# EAGLE schematic Eagle_LEDCUBE2 (EAGLE 6.5.0)

## Sheet 1 of 6: First Controller bank
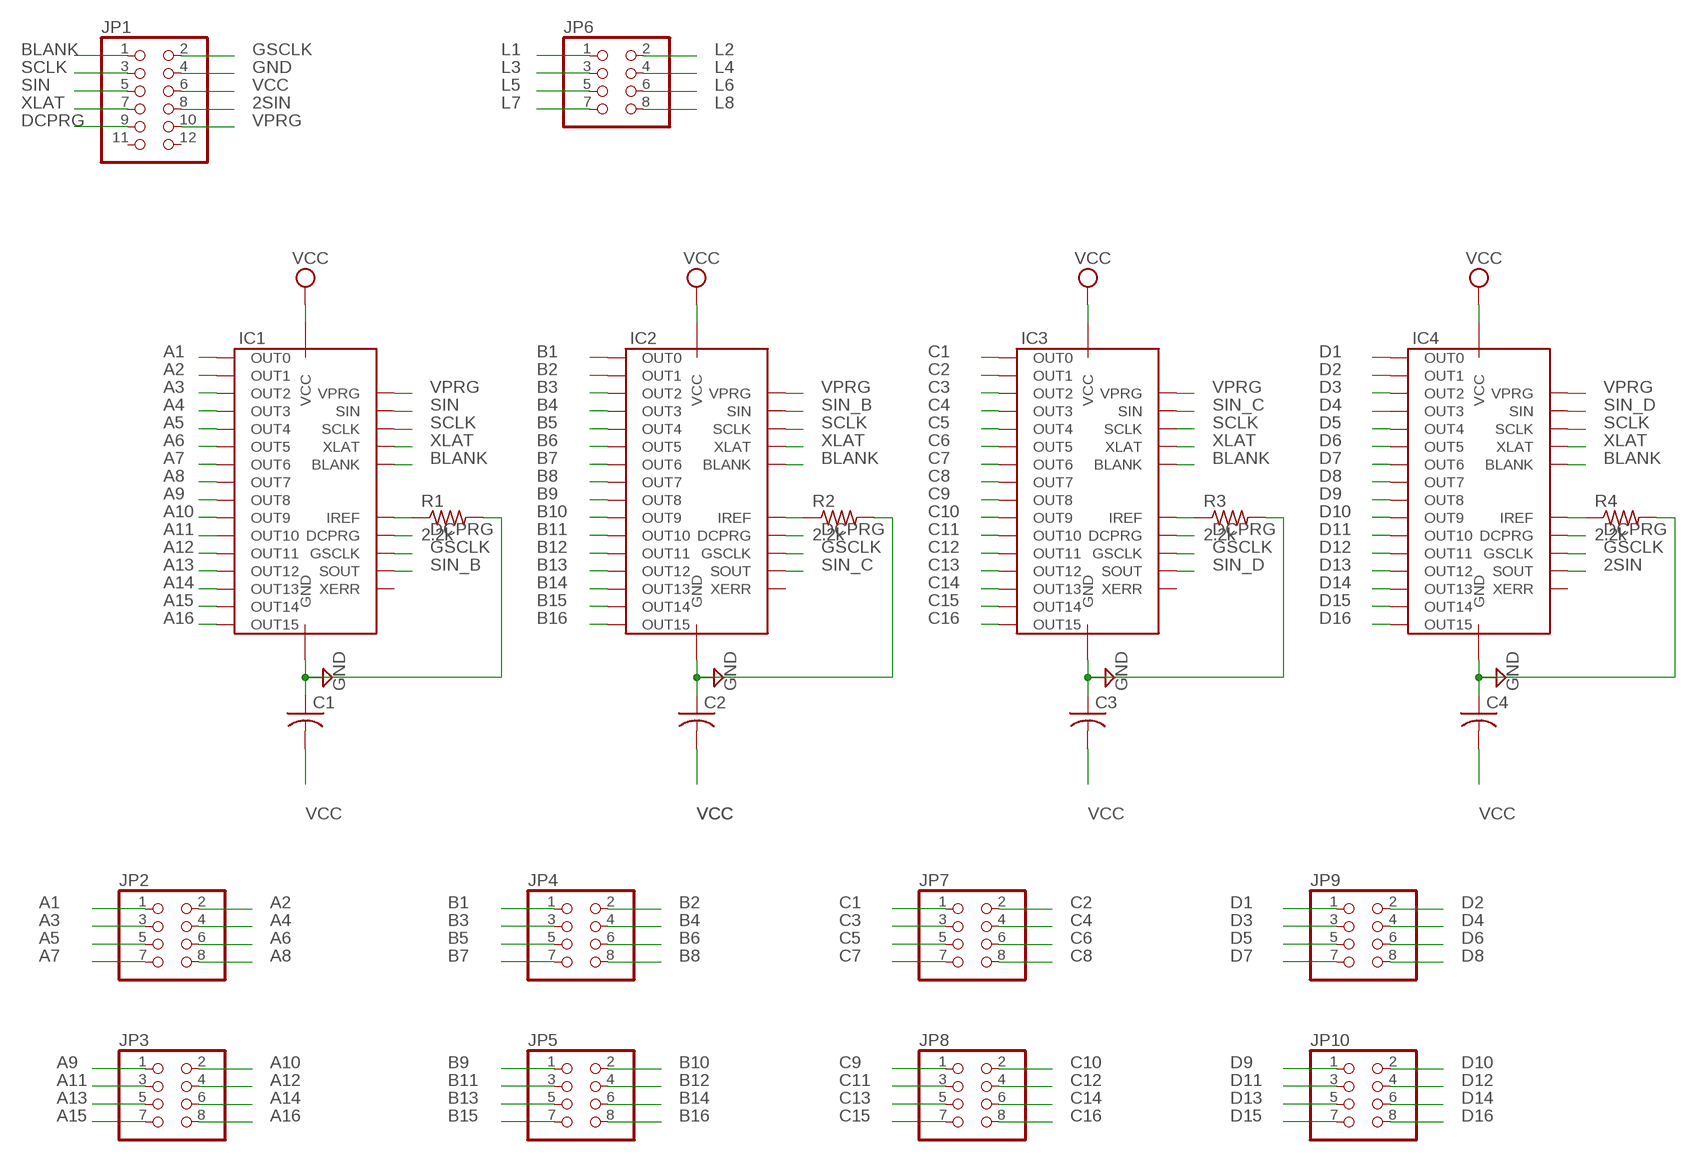
[diagram p0: schematic, sheet 1]

### Parts
C1  C-USC0805K  [C0805K]
C2  C-USC0805K  [C0805K]
C3  C-USC0805K  [C0805K]
C4  C-USC0805K  [C0805K]
IC1  IC-PACKAGE_DIL28-1  [IC-SSOP28]
IC2  IC-PACKAGE_DIL28-1  [IC-SSOP28]
IC3  IC-PACKAGE_DIL28-1  [IC-SSOP28]
IC4  IC-PACKAGE_DIL28-1  [IC-SSOP28]
JP1  PINHD-2X6  [2X06]
JP2  PINHD-2X4  [2X04]
JP3  PINHD-2X4  [2X04]
JP4  PINHD-2X4  [2X04]
JP5  PINHD-2X4  [2X04]
JP6  PINHD-2X4  [2X04]
JP7  PINHD-2X4  [2X04]
JP8  PINHD-2X4  [2X04]
JP9  PINHD-2X4  [2X04]
JP10  PINHD-2X4  [2X04]
R1  2.2k  R-US_R0805  [R0805]
R2  2.2k  R-US_R0805  [R0805]
R3  2.2k  R-US_R0805  [R0805]
R4  2.2k  R-US_R0805  [R0805]

### Nets
2SIN: IC4.24(SOUT) JP1.8 ; also sheet 2
A1: IC1.7(OUT0) JP2.1
A2: IC1.8(OUT1) JP2.2
A3: IC1.9(OUT2) JP2.3
A4: IC1.10(OUT3) JP2.4
A5: IC1.11(OUT4) JP2.5
A6: IC1.12(OUT5) JP2.6
A7: IC1.13(OUT6) JP2.7
A8: IC1.14(OUT7) JP2.8
A9: IC1.15(OUT8) JP3.1
A10: IC1.16(OUT9) JP3.2
A11: IC1.17(OUT10) JP3.3
A12: IC1.18(OUT11) JP3.4
A13: IC1.19(OUT12) JP3.5
A14: IC1.20(OUT13) JP3.6
A15: IC1.21(OUT14) JP3.7
A16: IC1.22(OUT15) JP3.8
B1: IC2.7(OUT0) JP4.1
B2: IC2.8(OUT1) JP4.2
B3: IC2.9(OUT2) JP4.3
B4: IC2.10(OUT3) JP4.4
B5: IC2.11(OUT4) JP4.5
B6: IC2.12(OUT5) JP4.6
B7: IC2.13(OUT6) JP4.7
B8: IC2.14(OUT7) JP4.8
B9: IC2.15(OUT8) JP5.1
B10: IC2.16(OUT9) JP5.2
B11: IC2.17(OUT10) JP5.3
B12: IC2.18(OUT11) JP5.4
B13: IC2.19(OUT12) JP5.5
B14: IC2.20(OUT13) JP5.6
B15: IC2.21(OUT14) JP5.7
B16: IC2.22(OUT15) JP5.8
BLANK: IC1.2(BLANK) IC2.2(BLANK) IC3.2(BLANK) IC4.2(BLANK) JP1.1 ; also sheet 2,3,4
C1: IC3.7(OUT0) JP7.1
C2: IC3.8(OUT1) JP7.2
C3: IC3.9(OUT2) JP7.3
C4: IC3.10(OUT3) JP7.4
C5: IC3.11(OUT4) JP7.5
C6: IC3.12(OUT5) JP7.6
C7: IC3.13(OUT6) JP7.7
C8: IC3.14(OUT7) JP7.8
C9: IC3.15(OUT8) JP8.1
C10: IC3.16(OUT9) JP8.2
C11: IC3.17(OUT10) JP8.3
C12: IC3.18(OUT11) JP8.4
C13: IC3.19(OUT12) JP8.5
C14: IC3.20(OUT13) JP8.6
C15: IC3.21(OUT14) JP8.7
C16: IC3.22(OUT15) JP8.8
D1: IC4.7(OUT0) JP9.1
D2: IC4.8(OUT1) JP9.2
D3: IC4.9(OUT2) JP9.3
D4: IC4.10(OUT3) JP9.4
D5: IC4.11(OUT4) JP9.5
D6: IC4.12(OUT5) JP9.6
D7: IC4.13(OUT6) JP9.7
D8: IC4.14(OUT7) JP9.8
D9: IC4.15(OUT8) JP10.1
D10: IC4.16(OUT9) JP10.2
D11: IC4.17(OUT10) JP10.3
D12: IC4.18(OUT11) JP10.4
D13: IC4.19(OUT12) JP10.5
D14: IC4.20(OUT13) JP10.6
D15: IC4.21(OUT14) JP10.7
D16: IC4.22(OUT15) JP10.8
DCPRG: IC1.26(DCPRG) IC2.26(DCPRG) IC3.26(DCPRG) IC4.26(DCPRG) JP1.9 ; also sheet 2,3,4
GND: C1.1 C2.1 C3.1 C4.1 IC1.1(GND) IC2.1(GND) IC3.1(GND) IC4.1(GND) JP1.4 R1.2 R2.2 R3.2 R4.2 ; also sheet 2,3,4,5,6
GSCLK: IC1.25(GSCLK) IC2.25(GSCLK) IC3.25(GSCLK) IC4.25(GSCLK) JP1.2 ; also sheet 2,3,4
L1: JP6.1 ; also sheet 5
L2: JP6.2 ; also sheet 5
L3: JP6.3 ; also sheet 5
L4: JP6.4 ; also sheet 5
L5: JP6.5 ; also sheet 5
L6: JP6.6 ; also sheet 5
L7: JP6.7 ; also sheet 5
L8: JP6.8 ; also sheet 5
N$5: IC1.27(IREF) R1.1
N$16: IC2.27(IREF) R2.1
N$26: IC3.27(IREF) R3.1
N$35: IC4.27(IREF) R4.1
SCLK: IC1.4(SCLK) IC2.4(SCLK) IC3.4(SCLK) IC4.4(SCLK) JP1.3 ; also sheet 2,3,4
SIN: IC1.5(SIN) JP1.5 ; also sheet 4
SIN_B: IC1.24(SOUT) IC2.5(SIN)
SIN_C: IC2.24(SOUT) IC3.5(SIN)
SIN_D: IC3.24(SOUT) IC4.5(SIN)
VCC: C1.2 C2.2 C3.2 C4.2 IC1.28(VCC) IC2.28(VCC) IC3.28(VCC) IC4.28(VCC) JP1.6 ; also sheet 2,3,5,6
VPRG: IC1.6(VPRG) IC2.6(VPRG) IC3.6(VPRG) IC4.6(VPRG) JP1.10 ; also sheet 2,3,4
XLAT: IC1.3(XLAT) IC2.3(XLAT) IC3.3(XLAT) IC4.3(XLAT) JP1.7 ; also sheet 2,3,4
Unconnected: IC1.23(XERR) IC2.23(XERR) IC3.23(XERR) IC4.23(XERR) JP1.11 JP1.12

## Sheet 2 of 6: Second Controller bank
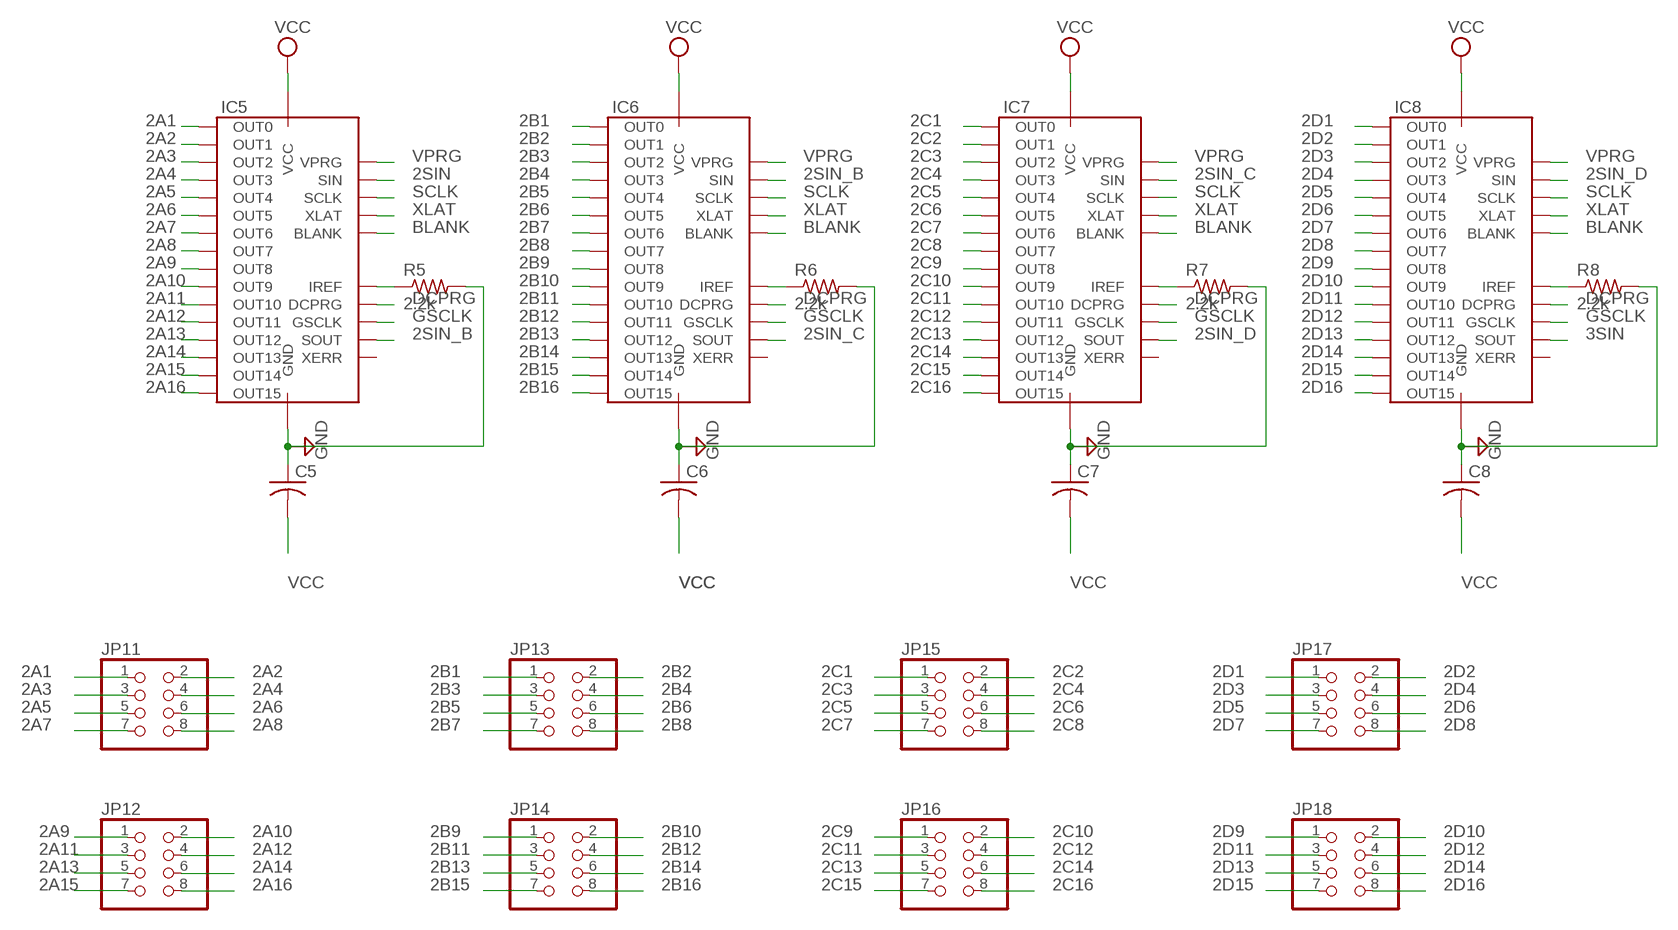
[diagram p1: schematic, sheet 2]

### Parts
C5  C-USC0805K  [C0805K]
C6  C-USC0805K  [C0805K]
C7  C-USC0805K  [C0805K]
C8  C-USC0805K  [C0805K]
IC5  IC-PACKAGE_DIL28-1  [IC-SSOP28]
IC6  IC-PACKAGE_DIL28-1  [IC-SSOP28]
IC7  IC-PACKAGE_DIL28-1  [IC-SSOP28]
IC8  IC-PACKAGE_DIL28-1  [IC-SSOP28]
JP11  PINHD-2X4  [2X04]
JP12  PINHD-2X4  [2X04]
JP13  PINHD-2X4  [2X04]
JP14  PINHD-2X4  [2X04]
JP15  PINHD-2X4  [2X04]
JP16  PINHD-2X4  [2X04]
JP17  PINHD-2X4  [2X04]
JP18  PINHD-2X4  [2X04]
R5  2.2k  R-US_R0805  [R0805]
R6  2.2k  R-US_R0805  [R0805]
R7  2.2k  R-US_R0805  [R0805]
R8  2.2k  R-US_R0805  [R0805]

### Nets
2A1: IC5.7(OUT0) JP11.1
2A2: IC5.8(OUT1) JP11.2
2A3: IC5.9(OUT2) JP11.3
2A4: IC5.10(OUT3) JP11.4
2A5: IC5.11(OUT4) JP11.5
2A6: IC5.12(OUT5) JP11.6
2A7: IC5.13(OUT6) JP11.7
2A8: IC5.14(OUT7) JP11.8
2A9: IC5.15(OUT8) JP12.1
2A10: IC5.16(OUT9) JP12.2
2A11: IC5.17(OUT10) JP12.3
2A12: IC5.18(OUT11) JP12.4
2A13: IC5.19(OUT12) JP12.5
2A14: IC5.20(OUT13) JP12.6
2A15: IC5.21(OUT14) JP12.7
2A16: IC5.22(OUT15) JP12.8
2B1: IC6.7(OUT0) JP13.1
2B2: IC6.8(OUT1) JP13.2
2B3: IC6.9(OUT2) JP13.3
2B4: IC6.10(OUT3) JP13.4
2B5: IC6.11(OUT4) JP13.5
2B6: IC6.12(OUT5) JP13.6
2B7: IC6.13(OUT6) JP13.7
2B8: IC6.14(OUT7) JP13.8
2B9: IC6.15(OUT8) JP14.1
2B10: IC6.16(OUT9) JP14.2
2B11: IC6.17(OUT10) JP14.3
2B12: IC6.18(OUT11) JP14.4
2B13: IC6.19(OUT12) JP14.5
2B14: IC6.20(OUT13) JP14.6
2B15: IC6.21(OUT14) JP14.7
2B16: IC6.22(OUT15) JP14.8
2C1: IC7.7(OUT0) JP15.1
2C2: IC7.8(OUT1) JP15.2
2C3: IC7.9(OUT2) JP15.3
2C4: IC7.10(OUT3) JP15.4
2C5: IC7.11(OUT4) JP15.5
2C6: IC7.12(OUT5) JP15.6
2C7: IC7.13(OUT6) JP15.7
2C8: IC7.14(OUT7) JP15.8
2C9: IC7.15(OUT8) JP16.1
2C10: IC7.16(OUT9) JP16.2
2C11: IC7.17(OUT10) JP16.3
2C12: IC7.18(OUT11) JP16.4
2C13: IC7.19(OUT12) JP16.5
2C14: IC7.20(OUT13) JP16.6
2C15: IC7.21(OUT14) JP16.7
2C16: IC7.22(OUT15) JP16.8
2D1: IC8.7(OUT0) JP17.1
2D2: IC8.8(OUT1) JP17.2
2D3: IC8.9(OUT2) JP17.3
2D4: IC8.10(OUT3) JP17.4
2D5: IC8.11(OUT4) JP17.5
2D6: IC8.12(OUT5) JP17.6
2D7: IC8.13(OUT6) JP17.7
2D8: IC8.14(OUT7) JP17.8
2D9: IC8.15(OUT8) JP18.1
2D10: IC8.16(OUT9) JP18.2
2D11: IC8.17(OUT10) JP18.3
2D12: IC8.18(OUT11) JP18.4
2D13: IC8.19(OUT12) JP18.5
2D14: IC8.20(OUT13) JP18.6
2D15: IC8.21(OUT14) JP18.7
2D16: IC8.22(OUT15) JP18.8
2SIN: IC5.5(SIN) ; also sheet 1
2SIN_B: IC5.24(SOUT) IC6.5(SIN)
2SIN_C: IC6.24(SOUT) IC7.5(SIN)
2SIN_D: IC7.24(SOUT) IC8.5(SIN)
3SIN: IC8.24(SOUT) ; also sheet 3
BLANK: IC5.2(BLANK) IC6.2(BLANK) IC7.2(BLANK) IC8.2(BLANK) ; also sheet 1,3,4
DCPRG: IC5.26(DCPRG) IC6.26(DCPRG) IC7.26(DCPRG) IC8.26(DCPRG) ; also sheet 1,3,4
GND: C5.1 C6.1 C7.1 C8.1 IC5.1(GND) IC6.1(GND) IC7.1(GND) IC8.1(GND) R5.2 R6.2 R7.2 R8.2 ; also sheet 1,3,4,5,6
GSCLK: IC5.25(GSCLK) IC6.25(GSCLK) IC7.25(GSCLK) IC8.25(GSCLK) ; also sheet 1,3,4
N$1: IC5.27(IREF) R5.1
N$2: IC6.27(IREF) R6.1
N$3: IC7.27(IREF) R7.1
N$4: IC8.27(IREF) R8.1
SCLK: IC5.4(SCLK) IC6.4(SCLK) IC7.4(SCLK) IC8.4(SCLK) ; also sheet 1,3,4
VCC: C5.2 C6.2 C7.2 C8.2 IC5.28(VCC) IC6.28(VCC) IC7.28(VCC) IC8.28(VCC) ; also sheet 1,3,5,6
VPRG: IC5.6(VPRG) IC6.6(VPRG) IC7.6(VPRG) IC8.6(VPRG) ; also sheet 1,3,4
XLAT: IC5.3(XLAT) IC6.3(XLAT) IC7.3(XLAT) IC8.3(XLAT) ; also sheet 1,3,4
Unconnected: IC5.23(XERR) IC6.23(XERR) IC7.23(XERR) IC8.23(XERR)

## Sheet 3 of 6: Third Controller bank
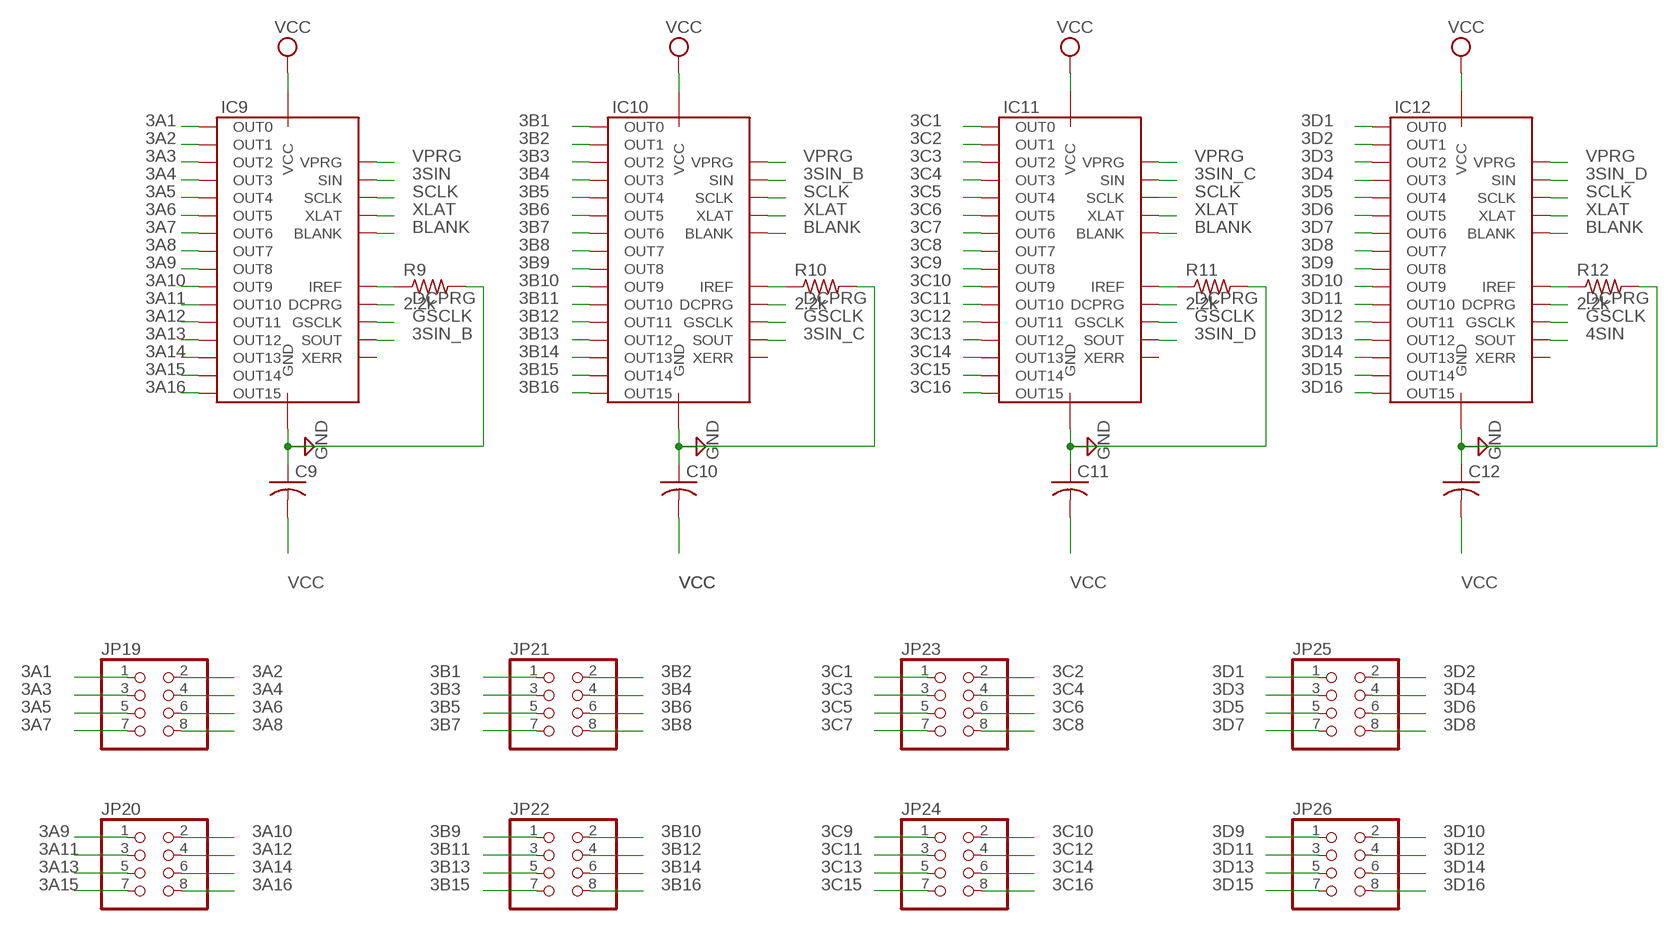
[diagram p2: schematic, sheet 3]

### Parts
C9  C-USC0805K  [C0805K]
C10  C-USC0805K  [C0805K]
C11  C-USC0805K  [C0805K]
C12  C-USC0805K  [C0805K]
IC9  IC-PACKAGE_DIL28-1  [IC-SSOP28]
IC10  IC-PACKAGE_DIL28-1  [IC-SSOP28]
IC11  IC-PACKAGE_DIL28-1  [IC-SSOP28]
IC12  IC-PACKAGE_DIL28-1  [IC-SSOP28]
JP19  PINHD-2X4  [2X04]
JP20  PINHD-2X4  [2X04]
JP21  PINHD-2X4  [2X04]
JP22  PINHD-2X4  [2X04]
JP23  PINHD-2X4  [2X04]
JP24  PINHD-2X4  [2X04]
JP25  PINHD-2X4  [2X04]
JP26  PINHD-2X4  [2X04]
R9  2.2k  R-US_R0805  [R0805]
R10  2.2k  R-US_R0805  [R0805]
R11  2.2k  R-US_R0805  [R0805]
R12  2.2k  R-US_R0805  [R0805]

### Nets
3A1: IC9.7(OUT0) JP19.1
3A2: IC9.8(OUT1) JP19.2
3A3: IC9.9(OUT2) JP19.3
3A4: IC9.10(OUT3) JP19.4
3A5: IC9.11(OUT4) JP19.5
3A6: IC9.12(OUT5) JP19.6
3A7: IC9.13(OUT6) JP19.7
3A8: IC9.14(OUT7) JP19.8
3A9: IC9.15(OUT8) JP20.1
3A10: IC9.16(OUT9) JP20.2
3A11: IC9.17(OUT10) JP20.3
3A12: IC9.18(OUT11) JP20.4
3A13: IC9.19(OUT12) JP20.5
3A14: IC9.20(OUT13) JP20.6
3A15: IC9.21(OUT14) JP20.7
3A16: IC9.22(OUT15) JP20.8
3B1: IC10.7(OUT0) JP21.1
3B2: IC10.8(OUT1) JP21.2
3B3: IC10.9(OUT2) JP21.3
3B4: IC10.10(OUT3) JP21.4
3B5: IC10.11(OUT4) JP21.5
3B6: IC10.12(OUT5) JP21.6
3B7: IC10.13(OUT6) JP21.7
3B8: IC10.14(OUT7) JP21.8
3B9: IC10.15(OUT8) JP22.1
3B10: IC10.16(OUT9) JP22.2
3B11: IC10.17(OUT10) JP22.3
3B12: IC10.18(OUT11) JP22.4
3B13: IC10.19(OUT12) JP22.5
3B14: IC10.20(OUT13) JP22.6
3B15: IC10.21(OUT14) JP22.7
3B16: IC10.22(OUT15) JP22.8
3C1: IC11.7(OUT0) JP23.1
3C2: IC11.8(OUT1) JP23.2
3C3: IC11.9(OUT2) JP23.3
3C4: IC11.10(OUT3) JP23.4
3C5: IC11.11(OUT4) JP23.5
3C6: IC11.12(OUT5) JP23.6
3C7: IC11.13(OUT6) JP23.7
3C8: IC11.14(OUT7) JP23.8
3C9: IC11.15(OUT8) JP24.1
3C10: IC11.16(OUT9) JP24.2
3C11: IC11.17(OUT10) JP24.3
3C12: IC11.18(OUT11) JP24.4
3C13: IC11.19(OUT12) JP24.5
3C14: IC11.20(OUT13) JP24.6
3C15: IC11.21(OUT14) JP24.7
3C16: IC11.22(OUT15) JP24.8
3D1: IC12.7(OUT0) JP25.1
3D2: IC12.8(OUT1) JP25.2
3D3: IC12.9(OUT2) JP25.3
3D4: IC12.10(OUT3) JP25.4
3D5: IC12.11(OUT4) JP25.5
3D6: IC12.12(OUT5) JP25.6
3D7: IC12.13(OUT6) JP25.7
3D8: IC12.14(OUT7) JP25.8
3D9: IC12.15(OUT8) JP26.1
3D10: IC12.16(OUT9) JP26.2
3D11: IC12.17(OUT10) JP26.3
3D12: IC12.18(OUT11) JP26.4
3D13: IC12.19(OUT12) JP26.5
3D14: IC12.20(OUT13) JP26.6
3D15: IC12.21(OUT14) JP26.7
3D16: IC12.22(OUT15) JP26.8
3SIN: IC9.5(SIN) ; also sheet 2
3SIN_B: IC9.24(SOUT) IC10.5(SIN)
3SIN_C: IC10.24(SOUT) IC11.5(SIN)
3SIN_D: IC11.24(SOUT) IC12.5(SIN)
4SIN: IC12.24(SOUT)
BLANK: IC9.2(BLANK) IC10.2(BLANK) IC11.2(BLANK) IC12.2(BLANK) ; also sheet 1,2,4
DCPRG: IC9.26(DCPRG) IC10.26(DCPRG) IC11.26(DCPRG) IC12.26(DCPRG) ; also sheet 1,2,4
GND: C9.1 C10.1 C11.1 C12.1 IC9.1(GND) IC10.1(GND) IC11.1(GND) IC12.1(GND) R9.2 R10.2 R11.2 R12.2 ; also sheet 1,2,4,5,6
GSCLK: IC9.25(GSCLK) IC10.25(GSCLK) IC11.25(GSCLK) IC12.25(GSCLK) ; also sheet 1,2,4
N$6: IC9.27(IREF) R9.1
N$7: IC10.27(IREF) R10.1
N$8: IC11.27(IREF) R11.1
N$9: IC12.27(IREF) R12.1
SCLK: IC9.4(SCLK) IC10.4(SCLK) IC11.4(SCLK) IC12.4(SCLK) ; also sheet 1,2,4
VCC: C9.2 C10.2 C11.2 C12.2 IC9.28(VCC) IC10.28(VCC) IC11.28(VCC) IC12.28(VCC) ; also sheet 1,2,5,6
VPRG: IC9.6(VPRG) IC10.6(VPRG) IC11.6(VPRG) IC12.6(VPRG) ; also sheet 1,2,4
XLAT: IC9.3(XLAT) IC10.3(XLAT) IC11.3(XLAT) IC12.3(XLAT) ; also sheet 1,2,4
Unconnected: IC9.23(XERR) IC10.23(XERR) IC11.23(XERR) IC12.23(XERR)

## Sheet 4 of 6: LPC1769 Board
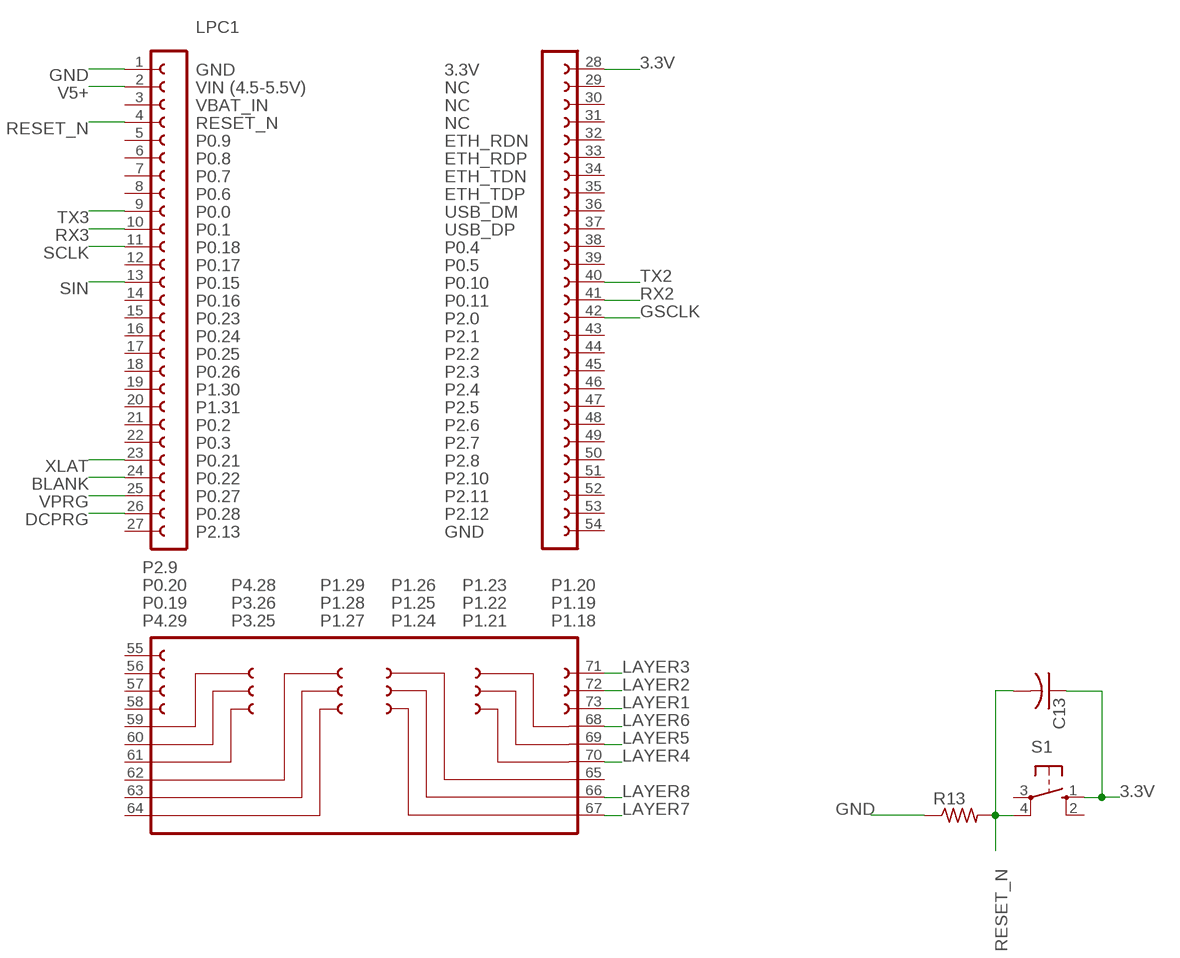
[diagram p3: schematic, sheet 4]

### Parts
C13  C-USC0805K  [C0805K]
LPC1  LPCXPRESSO_LPC1769  [LPCXPRESSO_LPC1769]
R13  R-US_R0805  [R0805]
S1  10-XX  [B3F-10XX]

### Nets
3.3V: C13.1 LPC1.28 S1.1(S)
BLANK: LPC1.24 ; also sheet 1,2,3
DCPRG: LPC1.26 ; also sheet 1,2,3
GND: LPC1.1 R13.1 ; also sheet 1,2,3,5,6
GSCLK: LPC1.42 ; also sheet 1,2,3
LAYER1: LPC1.73 ; also sheet 5
LAYER2: LPC1.72 ; also sheet 5
LAYER3: LPC1.71 ; also sheet 5
LAYER4: LPC1.70 ; also sheet 5
LAYER5: LPC1.69 ; also sheet 5
LAYER6: LPC1.68 ; also sheet 5
LAYER7: LPC1.67 ; also sheet 5
LAYER8: LPC1.66 ; also sheet 5
RESET_N: C13.2 LPC1.4 R13.2 S1.4(P1)
RX2: LPC1.41 ; also sheet 5
RX3: LPC1.10 ; also sheet 5
SCLK: LPC1.11 ; also sheet 1,2,3
SIN: LPC1.13 ; also sheet 1
TX2: LPC1.40 ; also sheet 5
TX3: LPC1.9 ; also sheet 5
V5+: LPC1.2 ; also sheet 5,6
VPRG: LPC1.25 ; also sheet 1,2,3
XLAT: LPC1.23 ; also sheet 1,2,3
Unconnected: LPC1.3 LPC1.5 LPC1.6 LPC1.7 LPC1.8 LPC1.12 LPC1.14 LPC1.15 LPC1.16 LPC1.17 LPC1.18 LPC1.19 LPC1.20 LPC1.21 LPC1.22 LPC1.27 LPC1.29 LPC1.30 LPC1.31 LPC1.32 LPC1.33 LPC1.34 LPC1.35 LPC1.36 LPC1.37 LPC1.38 LPC1.39 LPC1.43 LPC1.44 LPC1.45 LPC1.46 LPC1.47 LPC1.48 LPC1.49 LPC1.50 LPC1.51 LPC1.52 LPC1.53 LPC1.54 LPC1.55 LPC1.56 LPC1.57 LPC1.58 LPC1.59 LPC1.60 LPC1.61 LPC1.62 LPC1.63 LPC1.64 LPC1.65 S1.2(S1) S1.3(P)

## Sheet 5 of 6
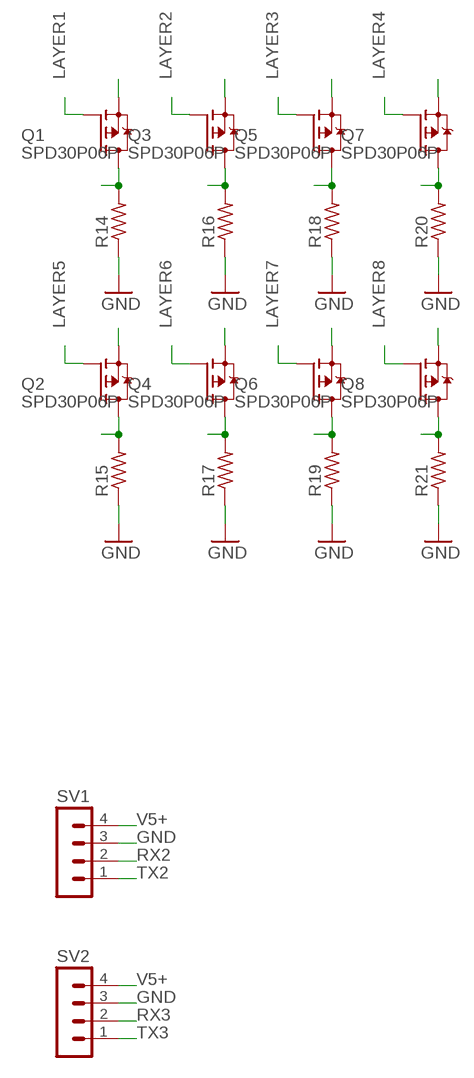
[diagram p4: schematic, sheet 5]

### Parts
Q1  SPD30P06P  [TO251AA]
Q2  SPD30P06P  [TO251AA]
Q3  SPD30P06P  [TO251AA]
Q4  SPD30P06P  [TO251AA]
Q5  SPD30P06P  [TO251AA]
Q6  SPD30P06P  [TO251AA]
Q7  SPD30P06P  [TO251AA]
Q8  SPD30P06P  [TO251AA]
R14  R-US_R0805  [R0805]
R15  R-US_R0805  [R0805]
R16  R-US_R0805  [R0805]
R17  R-US_R0805  [R0805]
R18  R-US_R0805  [R0805]
R19  R-US_R0805  [R0805]
R20  R-US_R0805  [R0805]
R21  R-US_R0805  [R0805]
SV1  MA04-1  [MA04-1]
SV2  MA04-1  [MA04-1]

### Nets
GND: R14.1 R15.1 R16.1 R17.1 R18.1 R19.1 R20.1 R21.1 SV1.3 SV2.3 ; also sheet 1,2,3,4,6
L1: Q1.2(D) R14.2 ; also sheet 1
L2: Q3.2(D) R16.2 ; also sheet 1
L3: Q5.2(D) R18.2 ; also sheet 1
L4: Q7.2(D) R20.2 ; also sheet 1
L5: Q2.2(D) R15.2 ; also sheet 1
L6: Q4.2(D) R17.2 ; also sheet 1
L7: Q6.2(D) R19.2 ; also sheet 1
L8: Q8.2(D) R21.2 ; also sheet 1
LAYER1: Q1.1(G) ; also sheet 4
LAYER2: Q3.1(G) ; also sheet 4
LAYER3: Q5.1(G) ; also sheet 4
LAYER4: Q7.1(G) ; also sheet 4
LAYER5: Q2.1(G) ; also sheet 4
LAYER6: Q4.1(G) ; also sheet 4
LAYER7: Q6.1(G) ; also sheet 4
LAYER8: Q8.1(G) ; also sheet 4
RX2: SV1.2 ; also sheet 4
RX3: SV2.2 ; also sheet 4
TX2: SV1.1 ; also sheet 4
TX3: SV2.1 ; also sheet 4
V5+: SV1.4 SV2.4 ; also sheet 4,6
VCC: Q1.3(S) Q2.3(S) Q3.3(S) Q4.3(S) Q5.3(S) Q6.3(S) Q7.3(S) Q8.3(S) ; also sheet 1,2,3,6

## Sheet 6 of 6: power
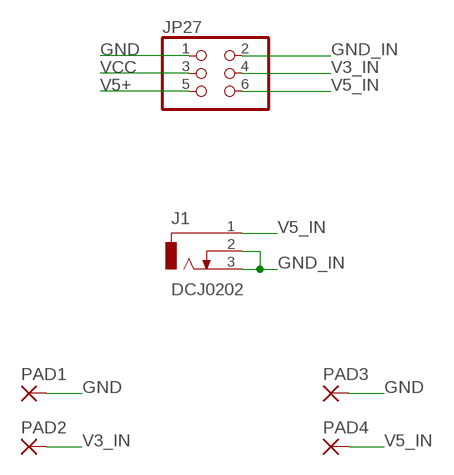
[diagram p5: schematic, sheet 6]

### Parts
J1  DCJ0202  [DCJ0202]
JP27  PINHD-2X3  [2X03]
PAD1  3,81/1,3  [3,81/1,3]
PAD2  3,81/1,3  [3,81/1,3]
PAD3  3,81/1,3  [3,81/1,3]
PAD4  3,81/1,3  [3,81/1,3]

### Nets
GND: JP27.1 PAD1.1(P) PAD3.1(P) ; also sheet 1,2,3,4,5
GND_IN: J1.2 J1.3 JP27.2
V3_IN: JP27.4 PAD2.1(P)
V5+: JP27.5 ; also sheet 4,5
V5_IN: J1.1 JP27.6 PAD4.1(P)
VCC: JP27.3 ; also sheet 1,2,3,5

## Library data of the parts
C1-C12 = resistor:C-US: CAPACITOR, American symbol
C13 = rcl:C-US: CAPACITOR, American symbol
IC1-IC12 = TLC5940:IC-PACKAGE_DIL28: Dual In Line
J1 = con-jack:DCJ0202: DC POWER JACK Source: DCJ0202.pdf; OC_FARNELL: unknown; OC_NEWARK: unknown
JP1 = pinhead:PINHD-2X6: PIN HEADER
JP2-JP26 = pinhead:PINHD-2X4: PIN HEADER
JP27 = pinhead:PINHD-2X3: PIN HEADER
LPC1 = LPCXpresso_boards:LPCXPRESSO_LPC1769
PAD1-PAD4 = wirepad:3,81/1,3: THROUGH-HOLE PAD
Q1-Q8 = transistor-fet:SPD30P06P: SIPMOS(R) Power-Transistor P-Channel, Enhancement mode Source: http://www.infineon.com/upload/Document/cmc_upload/documents/012/3615/SPD_U30P06P.pdf
R1-R12 R14-R21 = resistor:R-US_: RESISTOR, American symbol
R13 = rcl:R-US_: RESISTOR, American symbol
S1 = switch-omron:10-XX: OMRON SWITCH; MPN: B3F-1000; OC_FARNELL: 176432; OC_NEWARK: 36M3542
SV1 SV2 = con-lstb:MA04-1: PIN HEADER; OC_FARNELL: unknown; OC_NEWARK: unknown